# EAGLE design MainBoard (EAGLE 8.5.0)
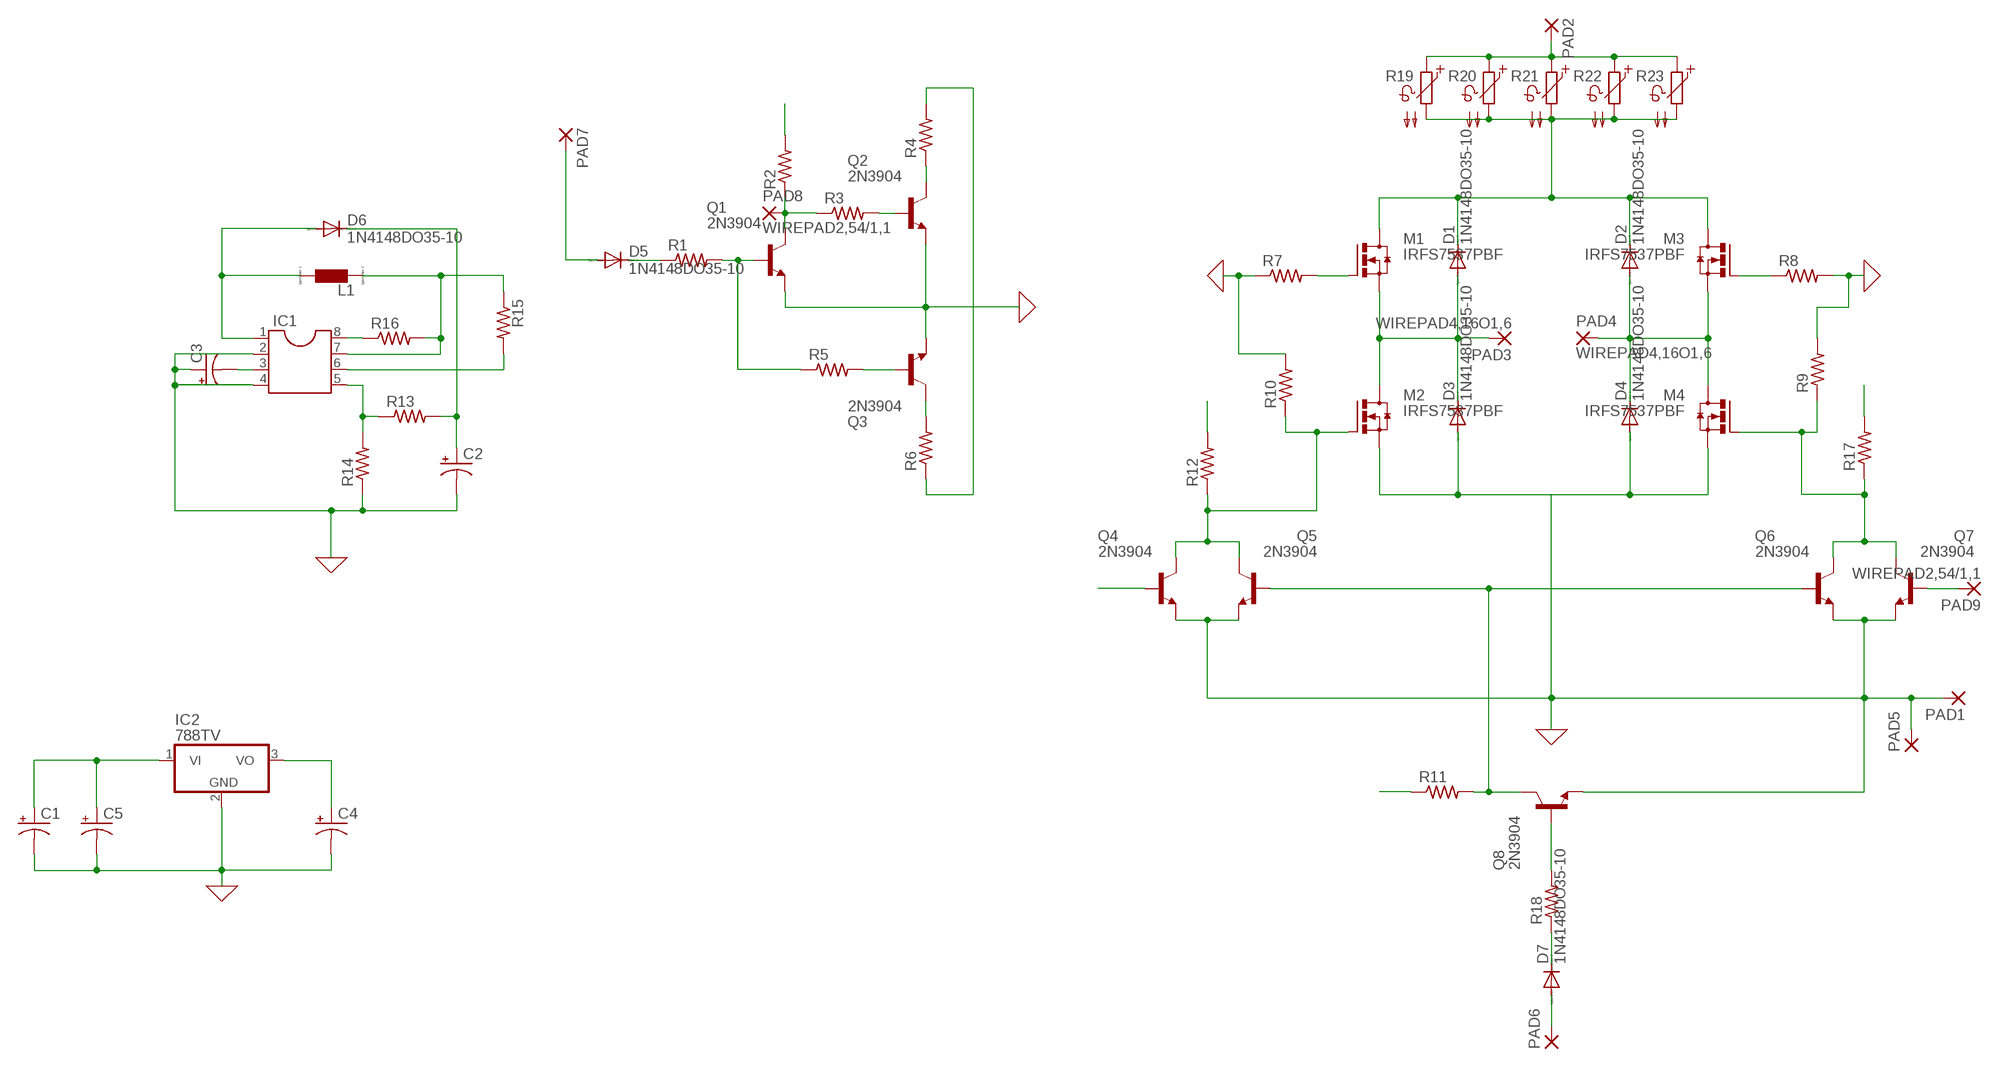
[diagram p0: schematic, sheet 1]

## Parts
C1  CPOL-USE2.5-7  [E2,5-7]
C2  CPOL-USE2.5-7  [E2,5-7]
C3  CPOL-USE2.5-7  [E2,5-7]
C4  CPOL-USE2.5-7  [E2,5-7]
C5  CPOL-USE2.5-7  [E2,5-7]
D1  1N4148DO35-10  [DO35-10]
D2  1N4148DO35-10  [DO35-10]
D3  1N4148DO35-10  [DO35-10]
D4  1N4148DO35-10  [DO35-10]
D5  1N4148DO35-10  [DO35-10]
D6  1N4148DO35-10  [DO35-10]
D7  1N4148DO35-10  [DO35-10]
IC1  DIL8  [DIL08]
IC2  788TV  [TO220V]
L1  L0207/10  [0207/10]
M1  IRFS7537PBF  [D2PACK]
M2  IRFS7537PBF  [D2PACK]
M3  IRFS7537PBF  [D2PACK]
M4  IRFS7537PBF  [D2PACK]
PAD1  3,81/1,4  [3,81/1,4]
PAD2  3,81/1,4  [3,81/1,4]
PAD3  WIREPAD4,16O1,6  [4,16O1,6]
PAD4  WIREPAD4,16O1,6  [4,16O1,6]
PAD5  3,81/1,4  [3,81/1,4]
PAD6  2,54/1,0  [2,54/1,0]
PAD7  2,54/1,0  [2,54/1,0]
PAD8  WIREPAD2,54/1,1  [2,54/1,1]
PAD9  WIREPAD2,54/1,1  [2,54/1,1]
Q1  2N3904  [TO92]
Q2  2N3904  [TO92]
Q3  2N3904  [TO92]
Q4  2N3904  [TO92]
Q5  2N3904  [TO92]
Q6  2N3904  [TO92]
Q7  2N3904  [TO92]
Q8  2N3904  [TO92]
R1  R-US_0207/7  [0207/7]
R2  R-US_0207/7  [0207/7]
R3  R-US_0207/7  [0207/7]
R4  R-US_0207/7  [0207/7]
R5  R-US_0207/7  [0207/7]
R6  R-US_0207/7  [0207/7]
R7  R-US_0207/7  [0207/7]
R8  R-US_0207/7  [0207/7]
R9  R-US_0207/7  [0207/7]
R10  R-US_0207/7  [0207/7]
R11  R-US_0207/7  [0207/7]
R12  R-US_0207/7  [0207/7]
R13  R-US_0207/7  [0207/7]
R14  R-US_0207/7  [0207/7]
R15  R-US_0207/7  [0207/7]
R16  R-US_0207/7  [0207/7]
R17  R-US_0309/12  [0309/12]
R18  R-US_0207/7  [0207/7]
R19  PTC660A  [P660A]
R20  PTC660A  [P660A]
R21  PTC660A  [P660A]
R22  PTC660A  [P660A]
R23  PTC660A  [P660A]

## Nets
0: C1.- C2.- C3.+ C4.- C5.- D3.A D4.A IC1.2 IC1.4 IC2.2(GND) M2.3(S) M4.3(S) PAD1.1(P) PAD5.1(P) Q1.3(E) Q2.3(E) Q3.3(E) Q4.3(E) Q5.3(E) Q6.3(E) Q7.3(E) Q8.3(E) R7.1 R8.2 R9.2 R10.2 R14.1 ; supply symbol labelled GND
BB: Q1.2(B) Q4.2(B) R1.2 R5.1
BF: M3.1(G) Q3.1(C) R6.2 R8.1
DIR: D5.A PAD7.1(P)
FB: PAD8.1(P) Q1.1(C) R2.1 R3.1
FBJ: PAD9.1(P) Q7.2(B)
FF: M1.1(G) Q2.1(C) R4.1 R7.2
MN: D2.A D4.C M3.3(S) M4.2(D) PAD4.1(P)
MP: D1.A D3.C M1.3(S) M2.2(D) PAD3.1(P)
N$1: PAD2.1(P) R19.1 R20.1 R21.1 R22.1 R23.1
N$2: D7.C R18.1
N$3: Q2.2(B) R3.2
N$4: D7.A PAD6.1(P)
N$5: D6.A IC1.1 L1.1
N$7: Q3.2(B) R5.2
N$10: C3.- IC1.3
N$11: IC1.8 R16.1
N$12: IC1.7 L1.2 R15.1 R16.2
N$13: IC1.5 R13.1 R14.2
N$16: Q5.2(B) Q6.2(B) Q8.1(C) R11.2
N$19: D5.C R1.1
N$20: M2.1(G) Q4.1(C) Q5.1(C) R10.1 R12.1
N$23: Q8.2(B) R18.2
N$27: M4.1(G) Q6.1(C) Q7.1(C) R9.1 R17.1
VDD: C1.+ C5.+ D1.C D2.C IC1.6 IC2.1(VI) M1.2(D) M3.2(D) R12.2 R15.2 R17.2 R19.2 R20.2 R21.2 R22.2 R23.2
VG: R4.2 R6.1
VG2: C2.+ D6.C R13.2
VSW: C4.+ IC2.3(VO) R2.2 R11.1

## Library data of the parts
C1-C5 = rcl:CPOL-US: POLARIZED CAPACITOR, American symbol; SPICEPREFIX: C
D1-D7 = diode:1N4148: DIODE high speed (Philips)
IC1 = ic-package:DIL8: Dual In Line / Socket
IC2 = linear:78*: Positive VOLTAGE REGULATOR Source: http://cache.national.com/ds/LM/LM78L05.pdf http://www.fairchildsemi.com/ds/LM/LM7805.pdf
L1 = eagle-ltspice:L: INDUCTOR, European symbol; SPICEMODEL: NONE; SPICEPREFIX: L
M1-M4 = EagleCAD:IRFS7537PBF: IRFS7537PBF Infineon International Rectifier DATASHEET: http://www.infineon.com/dgdl/irfs7537pbf.pdf?fileId=5546d462533600a4015364c3ee2729cb
PAD1 PAD2 PAD5 = wirepad:3,81/1,4: THROUGH-HOLE PAD
PAD3 PAD4 PAD8 PAD9 = wirepad:WIREPAD: Wire PAD connect wire on PCB
PAD6 PAD7 = wirepad:2,54/1,0: THROUGH-HOLE PAD
Q1-Q8 = transistor-npn:2N3904: NPN Transistor
R1-R16 R18 = rcl:R-US_: RESISTOR, American symbol; SPICEPREFIX: R
R17 = resistor:R-US_: RESISTOR, American symbol
R19-R23 = ptc-ntc:PTC660A: PHILIPS PTC; OC_FARNELL: unknown; OC_NEWARK: unknown

## Board
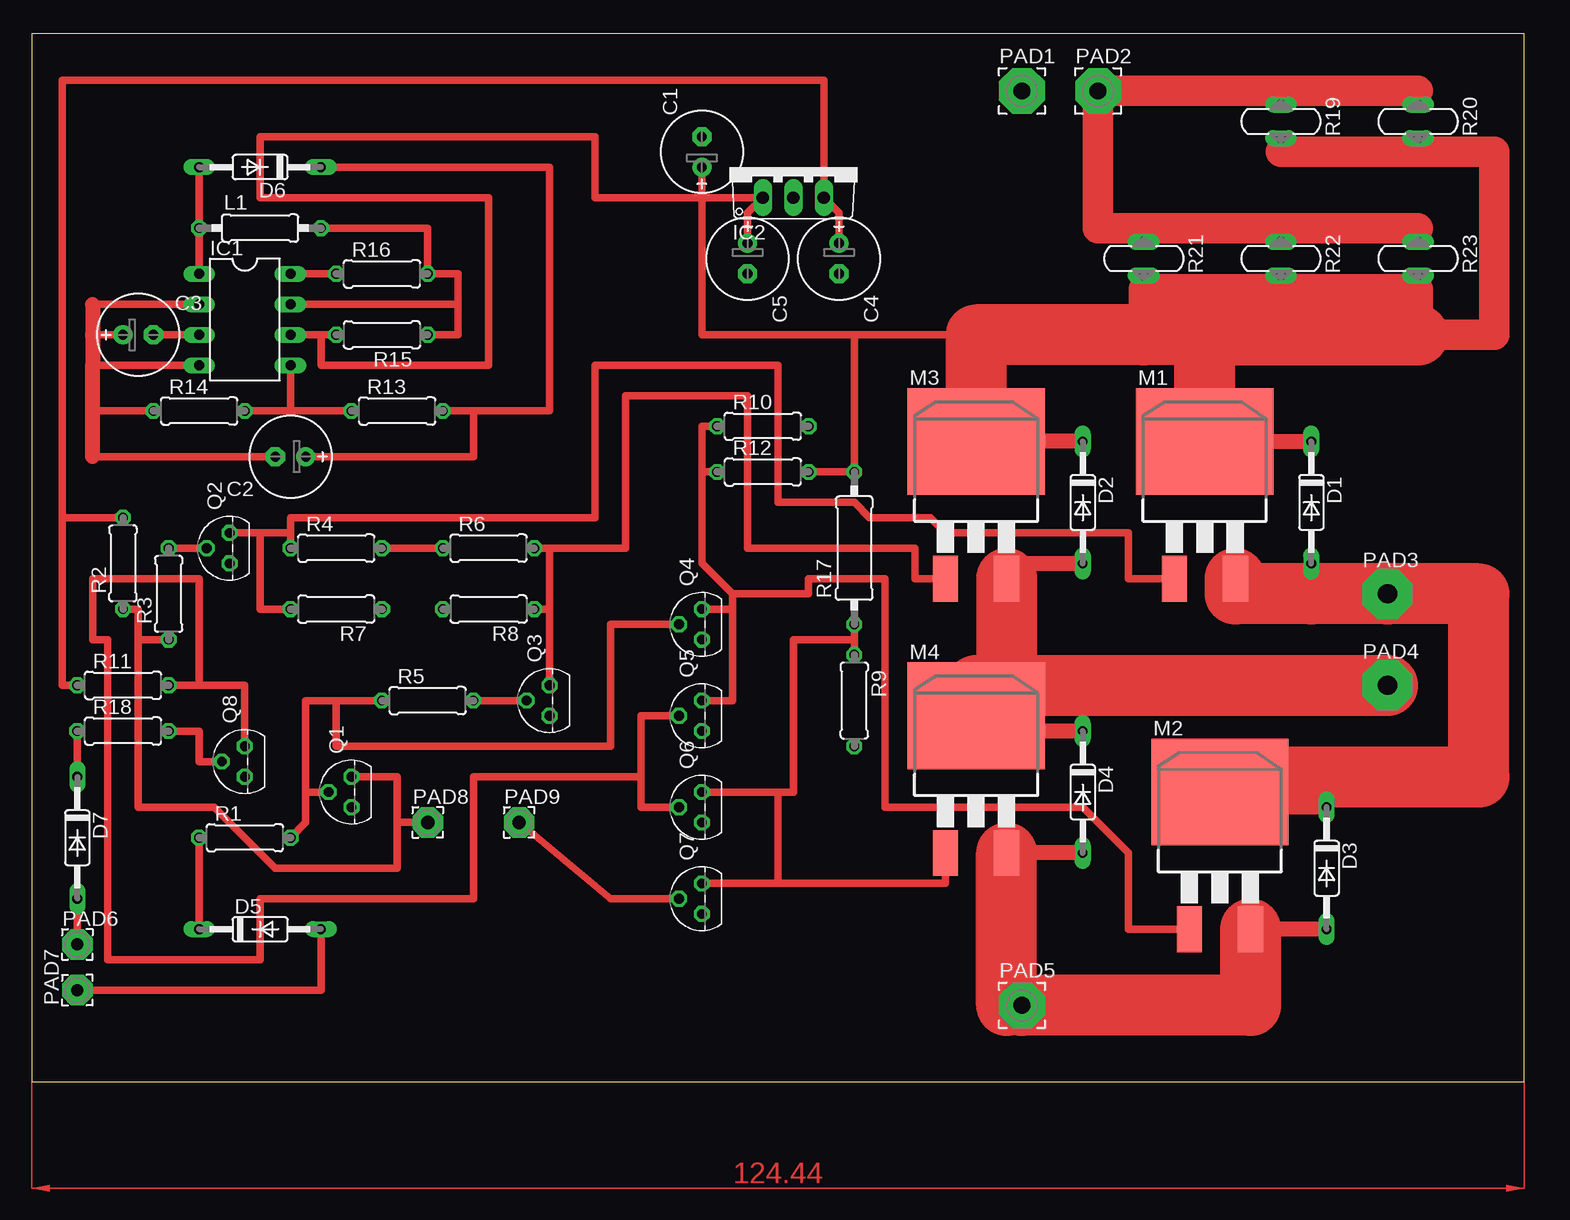
[diagram p1: board, top side]
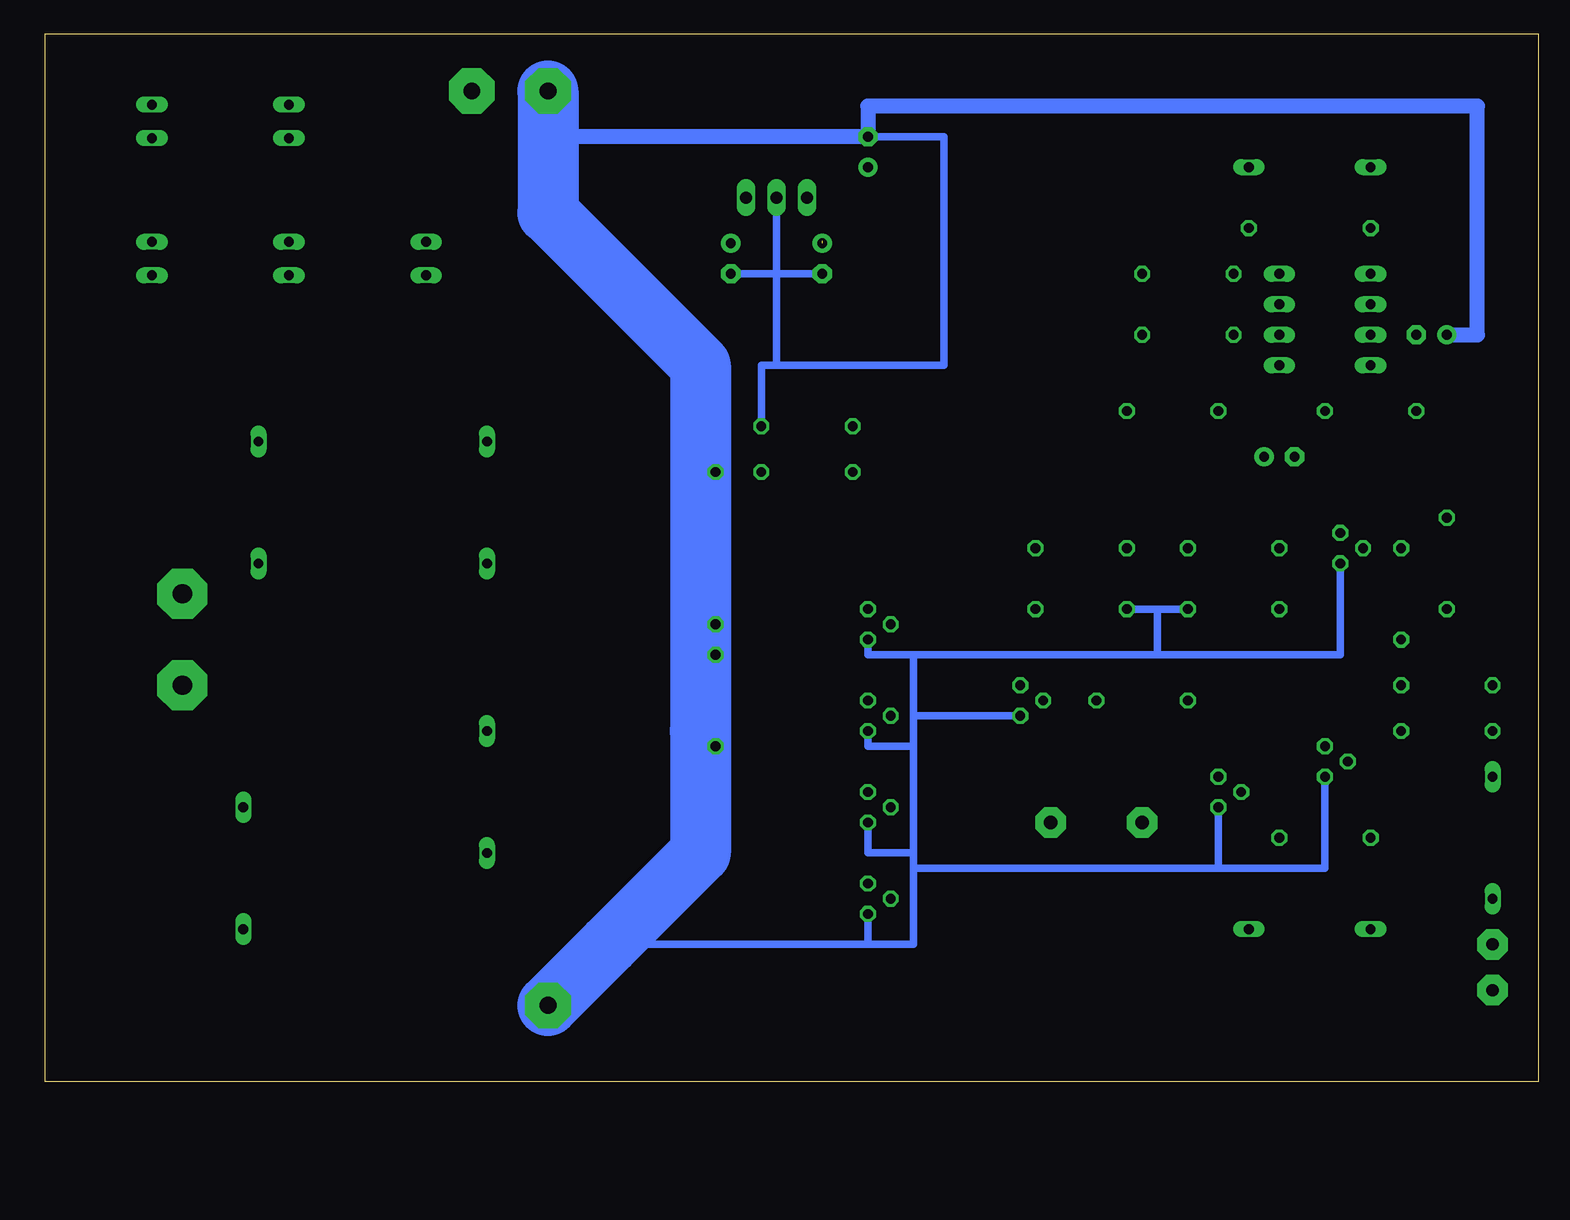
[diagram p2: board, bottom side, seen from below]

Size 124.44 x 87.3 mm. Coordinates in mm from the lower left corner, seen from the top.
Outline: 0,0 124.44,0 124.44,87.3 0,87.3 0,0
Copper layers (1*16): Top 0.035mm / dielectric 1.5mm / Bottom 0.035mm
Design rules "default": minimum track width 6mil, minimum drill 0.35mm, track to track 6mil, track to pad 6mil, pad to pad 6mil, via to via 6mil, smd to smd 6mil, copper to edge 40mil, drill to drill 6mil, minimum pad ring 10mil, minimum via ring 8mil, stop-mask expansion 4mil, vias tented up to drill 0mil, thermal gap 10mil

### Footprints (pad centres in the part's own frame; a part is rotated, then mirrored left to right if it is on the bottom)
E2,5-7 = drill 0.813 pad 1.6: + -1.27,0 | drill 0.813 pad 1.6 octagon: - 1.27,0
DO35-10 = drill 0.813 long: A 5.08,0; C -5.08,0
DIL08 = drill 0.813 long: 1 -3.81,-3.81; 2 -1.27,-3.81; 3 1.27,-3.81; 4 3.81,-3.81; 5 3.81,3.81; 6 1.27,3.81; 7 -1.27,3.81; 8 -3.81,3.81
TO220V = drill 1.016 long: 1 -2.54,-2.54; 2 0,-2.54; 3 2.54,-2.54
0207/10 = drill 0.813 octagon: 1 -5.08,0; 2 5.08,0
D2PACK = smd 2.083 x 3.81: 1 -2.54,-8.89; 3 2.54,-8.89 | smd 11.43 x 8.89: 2 0,2.54
3,81/1,4 = drill 1.397 pad 3.81 octagon: 1 0,0
4,16O1,6 = drill 1.6 pad 4.166 octagon: 1 0,0
2,54/1,0 = drill 1.016 pad 2.54 octagon: 1 0,0
2,54/1,1 = drill 1.118 pad 2.54 octagon: 1 0,0
TO92 = drill 0.813 octagon: 1 1.27,0; 2 0,1.905; 3 -1.27,0
0207/7 = drill 0.813 octagon: 1 -3.81,0; 2 3.81,0
0309/12 = drill 0.813 octagon: 1 -6.35,0; 2 6.35,0
P660A = drill 0.813 long: 1 -1.397,0; 2 1.397,0

### Placement (x,y rotation side)
C1  55.88,77.47 90 top
C2  21.59,52.07 180 top
C3  8.89,62.23 0 top
C4  67.31,68.58 270 top
C5  59.69,68.58 270 top
D1  106.68,48.26 270 top
D2  87.63,48.26 270 top
D3  107.95,17.78 270 top
D4  87.63,24.13 270 top
D5  19.05,12.7 0 top
D6  19.05,76.2 180 top
D7  3.81,20.32 270 top
IC1  17.78,63.5 270 top
IC2  63.5,76.2 0 top
L1  19.05,71.12 0 top
M1  97.79,50.8 0 top
M2  99.06,21.59 0 top
M3  78.74,50.8 0 top
M4  78.74,27.94 0 top
PAD1  82.55,82.55 0 top
PAD2  88.9,82.55 0 top
PAD3  113.03,40.64 0 top
PAD4  113.03,33.02 0 top
PAD5  82.55,6.35 0 top
PAD6  3.81,11.43 0 top
PAD7  3.81,7.62 90 top
PAD8  33.02,21.59 0 top
PAD9  40.64,21.59 0 top
Q1  26.67,24.13 90 top
Q2  16.51,44.45 90 top
Q3  43.18,31.75 90 top
Q4  55.88,38.1 90 top
Q5  55.88,30.48 90 top
Q6  55.88,22.86 90 top
Q7  55.88,15.24 90 top
Q8  17.78,26.67 90 top
R1  17.78,20.32 0 top
R2  7.62,43.18 90 top
R3  11.43,40.64 90 top
R4  25.4,44.45 0 top
R5  33.02,31.75 0 top
R6  38.1,44.45 0 top
R7  25.4,39.37 180 top
R8  38.1,39.37 180 top
R9  68.58,31.75 270 top
R10  60.96,54.61 0 top
R11  7.62,33.02 0 top
R12  60.96,50.8 0 top
R13  30.48,55.88 0 top
R14  13.97,55.88 0 top
R15  29.21,62.23 180 top
R16  29.21,67.31 0 top
R17  68.58,44.45 90 top
R18  7.62,29.21 0 top
R19  104.14,80.01 270 top
R20  115.57,80.01 270 top
R21  92.71,68.58 270 top
R22  104.14,68.58 270 top
R23  115.57,68.58 270 top

### Tracks (layer width: path | path; a pad name or v marks a point on that pad's centre or on a via)
0
  Top 0.61: 5.08,59.69 IC1.4 | IC1.2 5.08,64.77 | C3.+ 5.08,62.23 | R14.1 5.08,55.88 | C2.- 5.08,52.07
  Top 1.27: D3.A M2.3 | D4.A M4.3 | 5.08,64.77 5.08,62.23 5.08,59.69 5.08,55.88 5.08,52.07
  Top 3.81: PAD5.1 81.28,6.35
  Top 5.08: 81.28,6.35 M4.3 | M2.3 101.6,6.35 PAD5.1
  Bottom 0.61: IC2.2 63.5,67.31 | 63.5,67.31 C5.- | 63.5,67.31 C4.- | Q8.3 17.78,17.78 26.67,17.78 | 26.67,17.78 Q1.3 | 52.07,30.48 52.07,27.94 | 52.07,27.94 52.07,19.05 | 52.07,19.05 52.07,17.78 | 52.07,17.78 52.07,11.43 55.88,11.43 | Q3.3 52.07,30.48 | Q4.3 55.88,35.56 52.07,35.56 | 52.07,35.56 52.07,30.48 | Q5.3 55.88,27.94 52.07,27.94 | Q6.3 55.88,19.05 52.07,19.05 | Q7.3 55.88,11.43 | R10.2 64.77,59.69 63.5,59.69 | 63.5,59.69 49.53,59.69 49.53,78.74 C1.- | R7.1 31.75,39.37 | 31.75,39.37 R8.2 | 31.75,39.37 31.75,35.56 | 31.75,35.56 52.07,35.56 | Q2.3 16.51,35.56 31.75,35.56 | 63.5,67.31 63.5,59.69 | R9.2 69.85,29.21 | 55.88,11.43 77.47,11.43 | 26.67,17.78 52.07,17.78
  Bottom 1.27: PAD1.1 81.28,78.74 C1.- 55.88,81.28 5.08,81.28 5.08,62.23 C3.+
  Bottom 5.08: PAD1.1 82.55,72.39 69.85,59.69 69.85,29.21 69.85,19.05 77.47,11.43 PAD5.1
BB
  Top 0.61: 25.4,31.75 22.86,31.75 22.86,24.13 | 25.4,31.75 R5.1 | Q1.2 22.86,24.13 | Q4.2 48.26,38.1 48.26,27.94 25.4,27.94 25.4,31.75 | R1.2 22.86,21.59 22.86,24.13
BF
  Top 0.61: 43.18,39.37 R8.1 | M3.1 73.66,41.91 73.66,44.45 59.69,44.45 59.69,57.15 49.53,57.15 49.53,44.45 43.18,44.45 | 43.18,44.45 R6.2 | Q3.1 43.18,39.37 | 43.18,39.37 43.18,44.45
DIR
  Top 0.61: PAD7.1 24.13,7.62 D5.A
FB
  Top 0.61: R3.1 8.89,36.83 | R2.1 8.89,39.37 8.89,36.83 | Q1.1 30.48,25.4 30.48,21.59 | 30.48,21.59 PAD8.1 | 30.48,21.59 30.48,17.78 20.32,17.78 15.24,22.86 8.89,22.86 8.89,36.83
FBJ
  Top 0.61: PAD9.1 48.26,15.24 Q7.2
FF
  Top 0.61: Q2.1 19.05,45.72 | 19.05,45.72 21.59,45.72 | 21.59,45.72 R4.1 | 21.59,45.72 21.59,46.99 46.99,46.99 46.99,59.69 62.23,59.69 62.23,48.26 68.58,48.26 69.85,46.99 74.93,46.99 76.2,45.72 91.44,45.72 91.44,41.91 M1.1 | 19.05,45.72 19.05,39.37 R7.2
MN
  Top 0.152: 82.55,43.18 M3.3 | 80.01,33.02 M4.2 77.47,29.21
  Top 1.27: 82.55,43.18 D2.A | D4.C 77.47,29.21
  Top 3.81: 81.28,31.75 80.01,30.48 M4.2
  Top 5.08: M4.2 78.74,33.02 81.28,33.02 | 81.28,33.02 PAD4.1 | M3.3 81.28,33.02
MP
  Top 0.61: 99.06,22.86 M2.2
  Top 1.27: D3.C 99.06,22.86 | D1.A 106.68,40.64
  Top 3.81: M2.2 100.33,25.4
  Top 5.08: 100.33,25.4 120.65,25.4 120.65,40.64 PAD3.1 106.68,40.64 100.33,40.64 M1.3
N$1
  Top 1.27: R23.1 115.57,71.12 | R22.1 104.14,71.12 | R21.1 92.71,71.12 | R20.1 115.57,82.55 | R19.1 104.14,82.55
  Top 2.54: 89.31,82.96 PAD2.1 | PAD2.1 88.9,71.12 92.71,71.12 104.14,71.12 115.57,71.12 | 115.57,82.55 104.14,82.55 PAD2.1
N$2
  Top 0.61: R18.1 D7.C
N$3
  Top 0.61: Q2.2 R3.2
N$4
  Top 0.61: D7.A PAD6.1
N$5
  Top 0.61: D6.A L1.1 IC1.1
N$7
  Top 0.61: R5.2 Q3.2
N$10
  Top 0.61: C3.- IC1.3
N$11
  Top 0.61: R16.1 IC1.8
N$12
  Top 0.61: IC1.7 35.56,64.77 | 35.56,64.77 35.56,67.31 R16.2 33.02,71.12 L1.2 | 35.56,64.77 35.56,62.23 R15.1
N$13
  Top 0.61: R14.2 21.59,55.88 | 21.59,55.88 IC1.5 | 21.59,55.88 R13.1
N$16
  Top 0.61: R11.2 13.97,33.02 | 13.97,33.02 17.78,33.02 Q8.1 | Q5.2 50.8,30.48 50.8,25.4 | 50.8,25.4 50.8,22.86 Q6.2 | 13.97,33.02 13.97,41.91 5.08,41.91 5.08,36.83 6.35,36.83 6.35,10.16 19.05,10.16 19.05,15.24 36.83,15.24 36.83,25.4 50.8,25.4
N$19
  Top 0.61: R1.1 D5.C
N$20
  Top 0.61: M2.1 91.44,12.7 91.44,19.05 87.63,22.86 71.12,22.86 71.12,41.91 64.77,41.91 64.77,40.64 58.42,40.64 | Q4.1 58.42,39.37 | Q5.1 58.42,31.75 58.42,39.37 | 58.42,40.64 58.42,39.37 | R10.1 55.88,54.61 55.88,50.8 | 55.88,50.8 R12.1 | 55.88,50.8 55.88,43.18 58.42,40.64
N$23
  Top 0.61: R18.2 13.97,29.21 13.97,26.67 Q8.2
N$27
  Top 0.61: Q7.1 62.23,16.51 | 62.23,16.51 76.2,16.51 M4.1 | Q6.1 62.23,24.13 | 62.23,24.13 62.23,16.51 | R17.1 68.58,36.83 | 68.58,36.83 R9.1 | 62.23,24.13 63.5,24.13 63.5,36.83 68.58,36.83
VDD  (1 unrouted)
  Top 0.152: 78.74,57.15 M3.2 78.74,52.07
  Top 0.61: 59.69,70.08 59.69,72.39 IC2.1 55.88,73.66 | 55.88,73.66 55.88,62.23 68.58,62.23 | C1.+ 55.88,73.66 | R12.2 R17.2 68.58,62.23 | 68.58,62.23 78.74,62.23 81.28,62.23 | IC1.6 24.13,62.23 | 24.13,62.23 R15.2 | 24.13,62.23 24.13,59.69 38.1,59.69 38.1,73.66 19.05,73.66 19.05,78.74 46.99,78.74 46.99,73.66 55.88,73.66
  Top 0.813: 78.74,54.61 M3.2
  Top 1.27: M1.2 D1.C | D2.C M3.2 | R21.2 92.71,66.04 | R22.2 104.14,66.04 | R23.2 115.57,66.04 | R19.2 104.14,77.47 | R20.2 115.57,77.47
  Top 2.54: 104.14,77.47 115.57,77.47 121.92,77.47 121.92,62.23 115.57,62.23 115.57,66.04 104.14,66.04 | 92.71,62.23 92.71,66.04 104.14,66.04 | 104.14,66.04 104.14,62.23
  Top 3.81: 97.79,52.07 M1.2
  Top 5.08: 97.79,62.23 104.14,62.23 115.57,62.23 | M1.2 97.79,62.23 | M3.2 78.74,62.23 92.71,62.23 97.79,62.23
VG
  Top 0.61: R6.1 R4.2
VG2
  Top 0.61: D6.C 43.18,76.2 43.18,55.88 36.83,55.88 | R13.2 36.83,55.88 | C2.+ 36.83,52.07 36.83,55.88
VSW
  Top 0.61: C4.+ 67.31,72.39 IC2.3 66.04,83.44 2.54,83.44 2.54,46.99 | R2.2 2.54,46.99 | 2.54,46.99 2.54,33.02 R11.1
(copper drawn outside any net)
  shapes: Top area x1